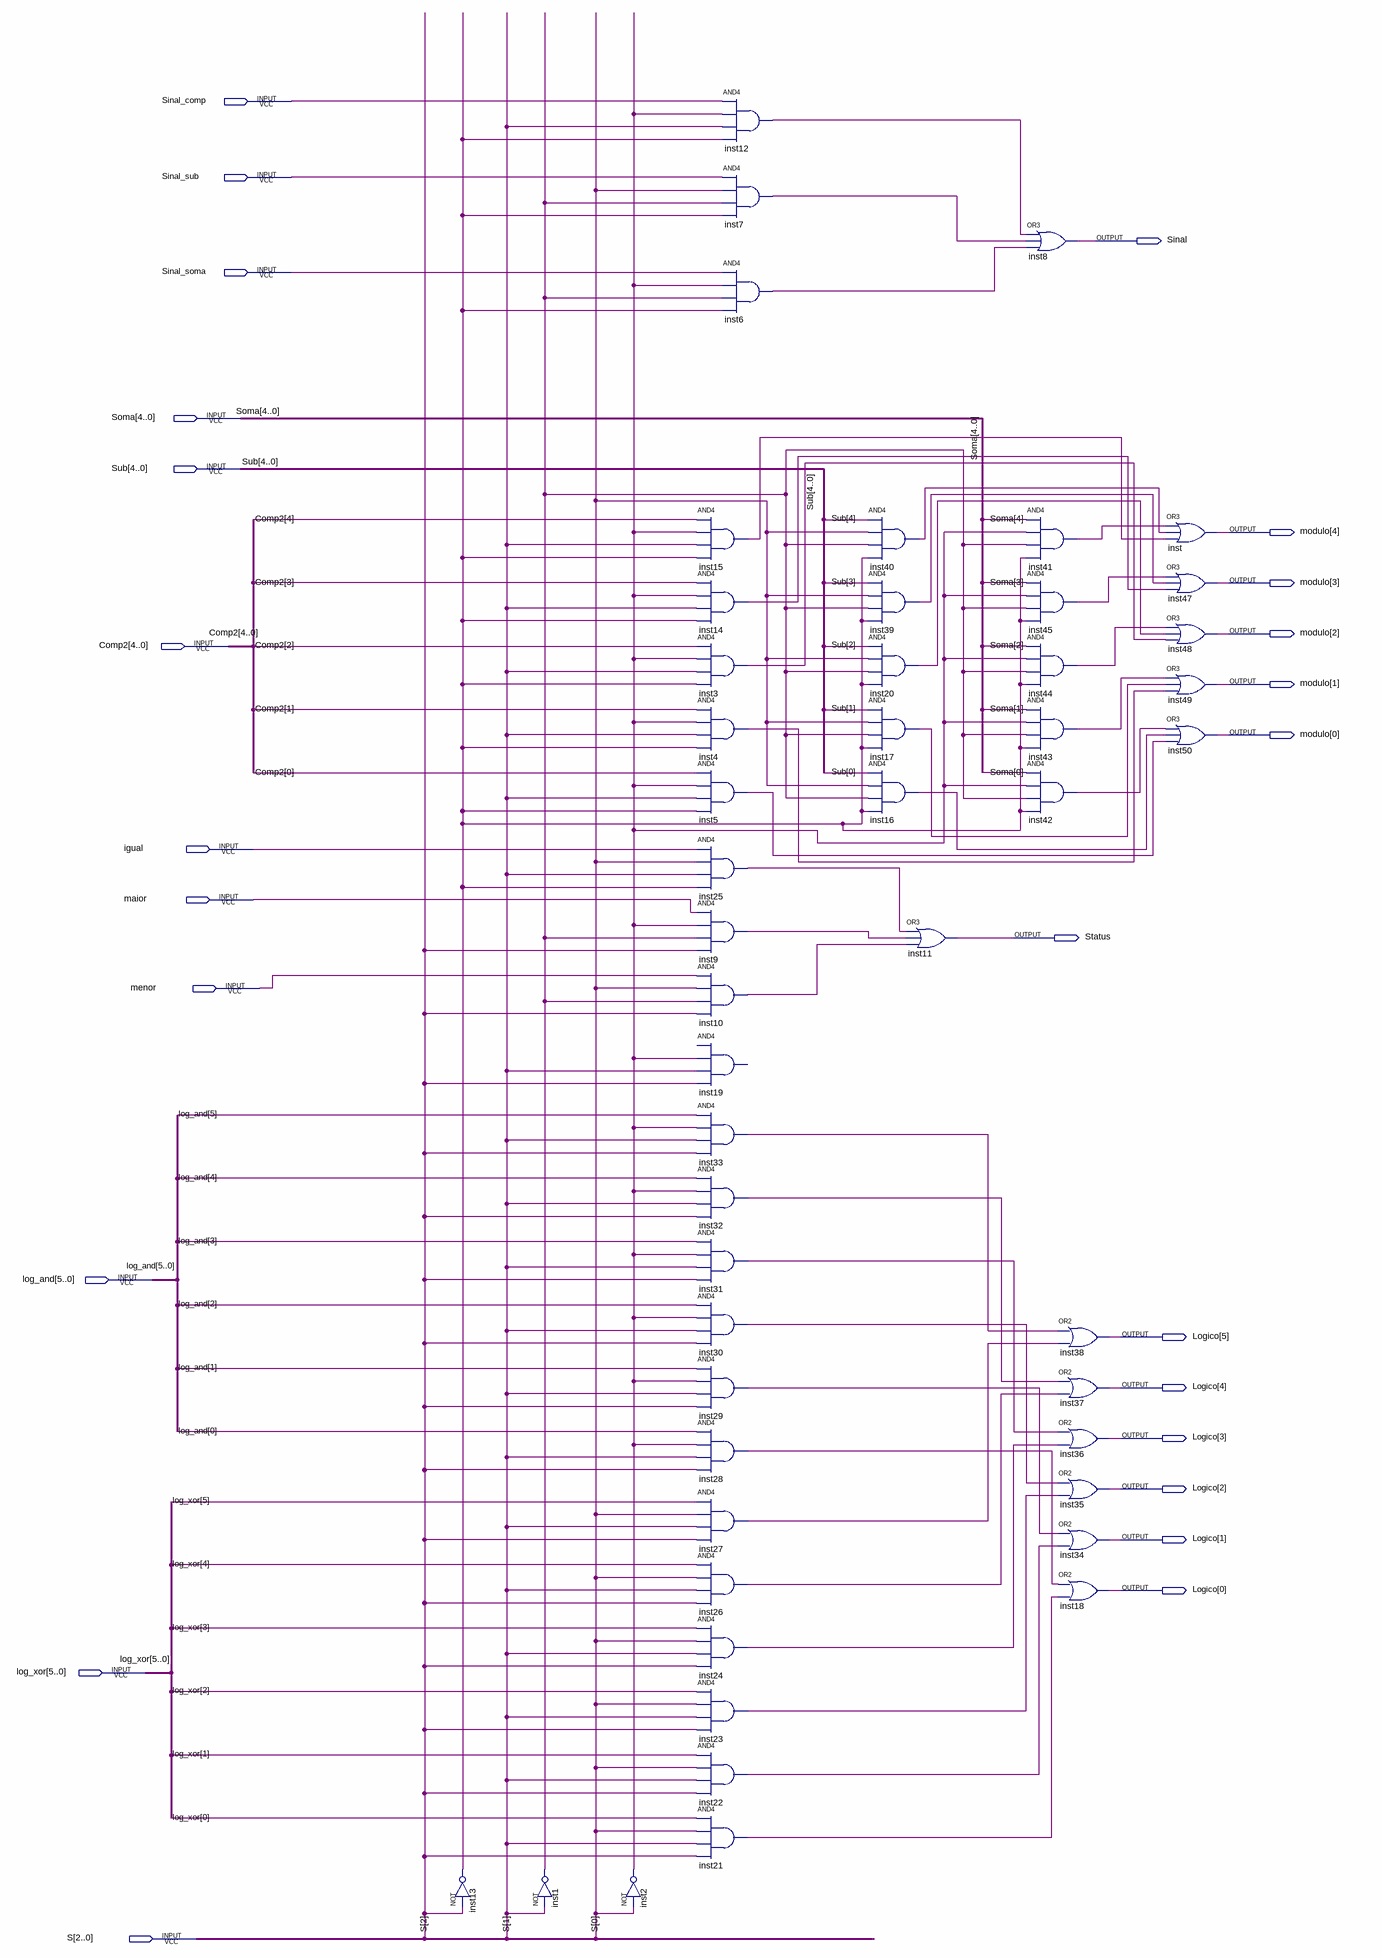
[diagram p0: schematic sheet]
// Quartus schematic mux_comparadorfinal_sinal.bdf as structural Verilog: 50 symbols, 25 pins
module mux_comparadorfinal_sinal (
  input  Sinal_comp,
  input  Sinal_sub,
  input  Sinal_soma,
  input  [4:0] Soma,
  input  [4:0] Sub,
  input  [4:0] Comp2,
  input  igual,
  input  maior,
  input  menor,
  input  [5:0] log_and,
  input  [5:0] log_xor,
  input  [2:0] S,
  output Sinal,
  output [4:0] modulo,
  output Status,
  output [5:0] Logico
);

  wire inst1_out, inst2_out, inst3_out, inst4_out, inst5_out, inst6_out, inst7_out, inst9_out, inst10_out,
       inst12_out, inst13_out, inst14_out, inst15_out, inst16_out, inst17_out, inst20_out, inst21_out,
       inst22_out, inst23_out, inst24_out, inst25_out, inst26_out, inst27_out, inst28_out, inst29_out,
       inst30_out, inst31_out, inst32_out, inst33_out, inst39_out, inst40_out, inst41_out, inst42_out,
       inst43_out, inst44_out, inst45_out;

  not inst13 (inst13_out, S[2]);
  not inst1 (inst1_out, S[1]);
  not inst2 (inst2_out, S[0]);
  and inst15 (inst15_out, Comp2[4], inst2_out, S[1], inst13_out);
  and inst14 (inst14_out, Comp2[3], inst2_out, S[1], inst13_out);
  and inst3 (inst3_out, Comp2[2], inst2_out, S[1], inst13_out);
  and inst4 (inst4_out, Comp2[1], inst2_out, S[1], inst13_out);
  and inst5 (inst5_out, Comp2[0], inst2_out, S[1], inst13_out);
  and inst25 (inst25_out, igual, S[0], S[1], inst13_out);
  and inst9 (inst9_out, maior, inst2_out, inst1_out, S[2]);
  and inst10 (inst10_out, menor, S[0], inst1_out, S[2]);
  // AND4 inst19 has open pins: IN1=open, IN2=inst2_out, IN3=S[1], IN4=S[2], OUT=open
  and inst33 (inst33_out, log_and[5], inst2_out, S[1], S[2]);
  and inst32 (inst32_out, log_and[4], inst2_out, S[1], S[2]);
  and inst31 (inst31_out, log_and[3], inst2_out, S[1], S[2]);
  and inst30 (inst30_out, log_and[2], inst2_out, S[1], S[2]);
  and inst29 (inst29_out, log_and[1], inst2_out, S[1], S[2]);
  and inst28 (inst28_out, log_and[0], inst2_out, S[1], S[2]);
  and inst27 (inst27_out, log_xor[5], S[0], S[1], S[2]);
  and inst26 (inst26_out, log_xor[4], S[0], S[1], S[2]);
  and inst24 (inst24_out, log_xor[3], S[0], S[1], S[2]);
  and inst23 (inst23_out, log_xor[2], S[0], S[1], S[2]);
  and inst22 (inst22_out, log_xor[1], S[0], S[1], S[2]);
  and inst21 (inst21_out, log_xor[0], S[0], S[1], S[2]);
  and inst12 (inst12_out, Sinal_comp, inst2_out, S[1], inst13_out);
  and inst7 (inst7_out, Sinal_sub, S[0], inst1_out, inst13_out);
  and inst6 (inst6_out, Sinal_soma, inst2_out, inst1_out, inst13_out);
  and inst40 (inst40_out, Sub[4], S[0], inst1_out, inst13_out);
  and inst39 (inst39_out, Sub[3], S[0], inst1_out, inst13_out);
  and inst20 (inst20_out, Sub[2], S[0], inst1_out, inst13_out);
  and inst17 (inst17_out, Sub[1], S[0], inst1_out, inst13_out);
  and inst16 (inst16_out, Sub[0], S[0], inst1_out, inst13_out);
  or inst11 (Status, inst25_out, inst9_out, inst10_out);
  or inst8 (Sinal, inst12_out, inst7_out, inst6_out);
  and inst41 (inst41_out, Soma[4], inst2_out, inst1_out, inst13_out);
  and inst45 (inst45_out, Soma[3], inst2_out, inst1_out, inst13_out);
  and inst44 (inst44_out, Soma[2], inst2_out, inst1_out, inst13_out);
  and inst43 (inst43_out, Soma[1], inst2_out, inst1_out, inst13_out);
  and inst42 (inst42_out, Soma[0], inst2_out, inst1_out, inst13_out);
  or inst38 (Logico[5], inst33_out, inst27_out);
  or inst37 (Logico[4], inst32_out, inst26_out);
  or inst36 (Logico[3], inst31_out, inst24_out);
  or inst35 (Logico[2], inst30_out, inst23_out);
  or inst34 (Logico[1], inst29_out, inst22_out);
  or inst18 (Logico[0], inst28_out, inst21_out);
  or inst (modulo[4], inst41_out, inst40_out, inst15_out);
  or inst47 (modulo[3], inst45_out, inst39_out, inst14_out);
  or inst48 (modulo[2], inst44_out, inst20_out, inst3_out);
  or inst49 (modulo[1], inst43_out, inst17_out, inst4_out);
  or inst50 (modulo[0], inst42_out, inst16_out, inst5_out);
endmodule
